# EAGLE design throughHoleAdapterTransistor (EAGLE 6.5.0)
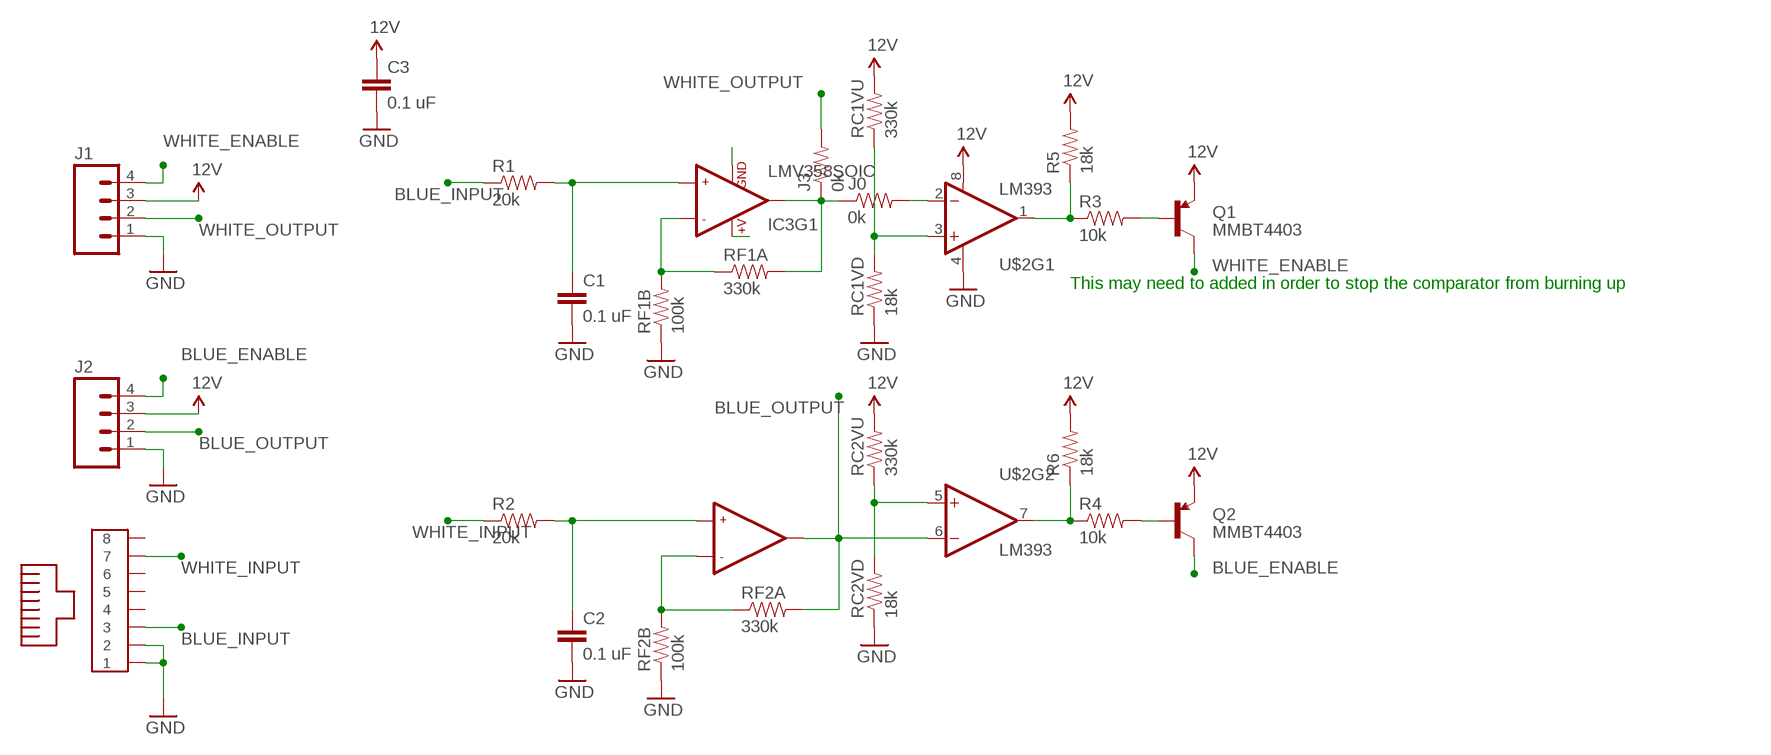
[diagram p0: schematic, sheet 1]

## Parts
C1  0.1 uF  CAP1206  [1206]
C2  0.1 uF  CAP1206  [1206]
C3  0.1 uF  CAP1206  [1206]
IC3  LMV358SOIC  [SO08]
J0  0k  RESISTOR1206  [1206]
J1  M04LONGPADS  [1X04_LONGPADS]
J2  M04LONGPADS  [1X04_LONGPADS]
J3  0k  RESISTOR1206  [1206]
Q1  MMBT4403  TRANSISTOR_PNPMMBT4403  [SOT23-3]
Q2  MMBT4403  TRANSISTOR_PNPMMBT4403  [SOT23-3]
R1  20k  RESISTOR1206  [1206]
R2  20k  RESISTOR1206  [1206]
R3  10k  RESISTOR1206  [1206]
R4  10k  RESISTOR1206  [1206]
R5  18k  RESISTOR1206  [1206]
R6  18k  RESISTOR1206  [1206]
RC1VD  18k  RESISTOR1206  [1206]
RC1VU  330k  RESISTOR1206  [1206]
RC2VD  18k  RESISTOR1206  [1206]
RC2VU  330k  RESISTOR1206  [1206]
RF1A  330k  RESISTOR1206  [1206]
RF1B  100k  RESISTOR1206  [1206]
RF2A  330k  RESISTOR1206  [1206]
RF2B  100k  RESISTOR1206  [1206]
U$1  MOLEX-RJ45-SMT  [MOLEX-RJ45-SMT]
U$2  LM393  [SO08]

## Nets
12V: C3.1 IC3.8(+V) J1.3 J2.3 Q1.2(E) Q2.2(E) R5.2 R6.2 RC1VU.2 RC2VU.2 U$2.8(V+)
BLUE_ENABLE: J2.4 Q2.3(C)
BLUE_INPUT: R1.1 U$1.3
BLUE_OUTPUT: IC3.7(OUT2) J2.2 RF2A.2 U$2.6(-IN)
GND: C1.2 C2.2 C3.2 IC3.4(GND) J1.1 J2.1 RC1VD.1 RC2VD.1 RF1B.1 RF2B.1 U$1.1 U$1.2 U$2.4(V-)
N$1: Q2.1(B) R4.2
N$2: J0.2 U$2.2(-IN)
N$3: R3.1 R5.1 U$2.1(OUT)
N$4: IC3.2(-IN1) RF1A.1 RF1B.2
N$5: RC2VD.2 RC2VU.1 U$2.5(+IN)
N$6: IC3.6(-IN2) RF2A.1 RF2B.2
N$7: C1.1 IC3.3(+IN1) R1.2
N$8: C2.1 IC3.5(+IN2) R2.2
N$9: RC1VD.2 RC1VU.1 U$2.3(+IN)
N$10: Q1.1(B) R3.2
N$11: R4.1 R6.1 U$2.7(OUT)
WHITE_ENABLE: J1.4 Q1.3(C)
WHITE_INPUT: R2.1 U$1.7
WHITE_OUTPUT: J1.2 J3.2
WHITE_OUTPUT_TEMP: IC3.1(OUT1) J0.1 J3.1 RF1A.2
Unconnected: U$1.4 U$1.5 U$1.6 U$1.8

## Notes on the sheet
- This may need to added in order to stop the comparator from burning up

## Library data of the parts
C1-C3 = SparkFun-Capacitors:CAP: Capacitor Standard 0603 ceramic capacitor, and 0.1" leaded capacitor.
IC3 = SparkFun-AnalogIC:LMV358: Jellybean rail-to-rail output op-amp; PROD_ID: IC-09657
J0 J3 R1-R6 RC1VD RC1VU RC2VD RC2VU RF1A RF1B RF2A RF2B = SparkFun-Resistors:RESISTOR: Resistor Basic schematic elements and footprints for 0603, 1206, and PTH resistors.
J1 J2 = SparkFun-Connectors:M04: Header 4 Standard 4-pin 0.1" header. Use with straight break away headers (SKU : PRT-00116), right angle break away headers (PRT-00553), swiss pins (PRT-00743), machine pins (PRT-00117), and female headers (PRT-00115). Molex polarized connector foot print use with SKU : PRT-08231 with associated crimp pins and housings. 1MM SMD Version SKU: PRT-10208; PROD_ID: CONN-09696
Q1 Q2 = SparkFun-DiscreteSemi:TRANSISTOR_PNP: Generic PNP BJT Double check pinouts against datasheets- not all devices are the same! MMBT3906 - 40V 200mA SOT-23 (TRANS-08052) MMBT4403 - 40V 600mA SOT-23 (TRANS-09245); PROD_ID: TRANS-09245
U$1 = SMD-RJ45:MOLEX-RJ45-SMT
U$2 = SparkFun-AnalogIC:LM393: Low-voltage comparator

## Board
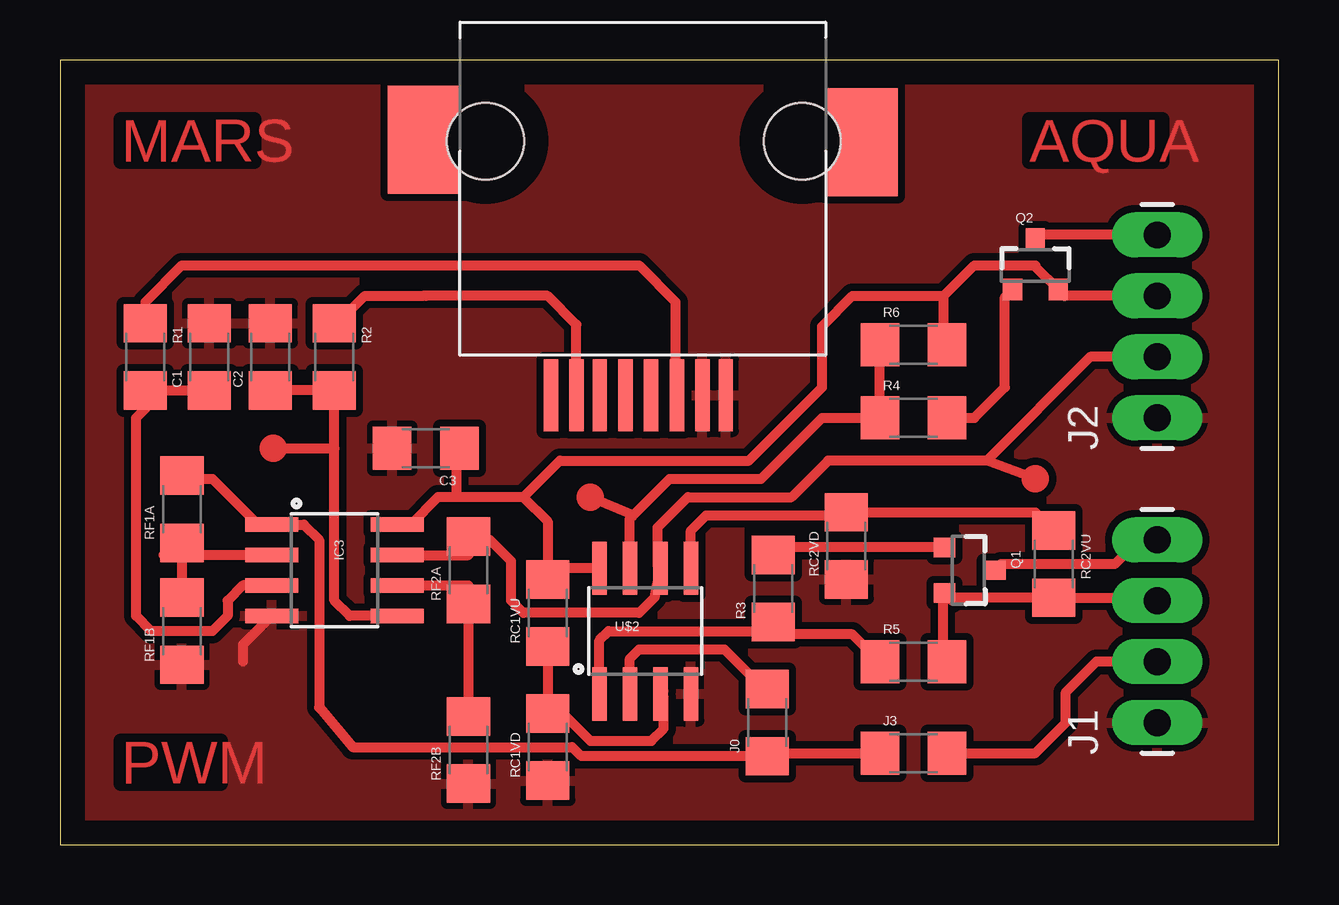
[diagram p1: board, top side]
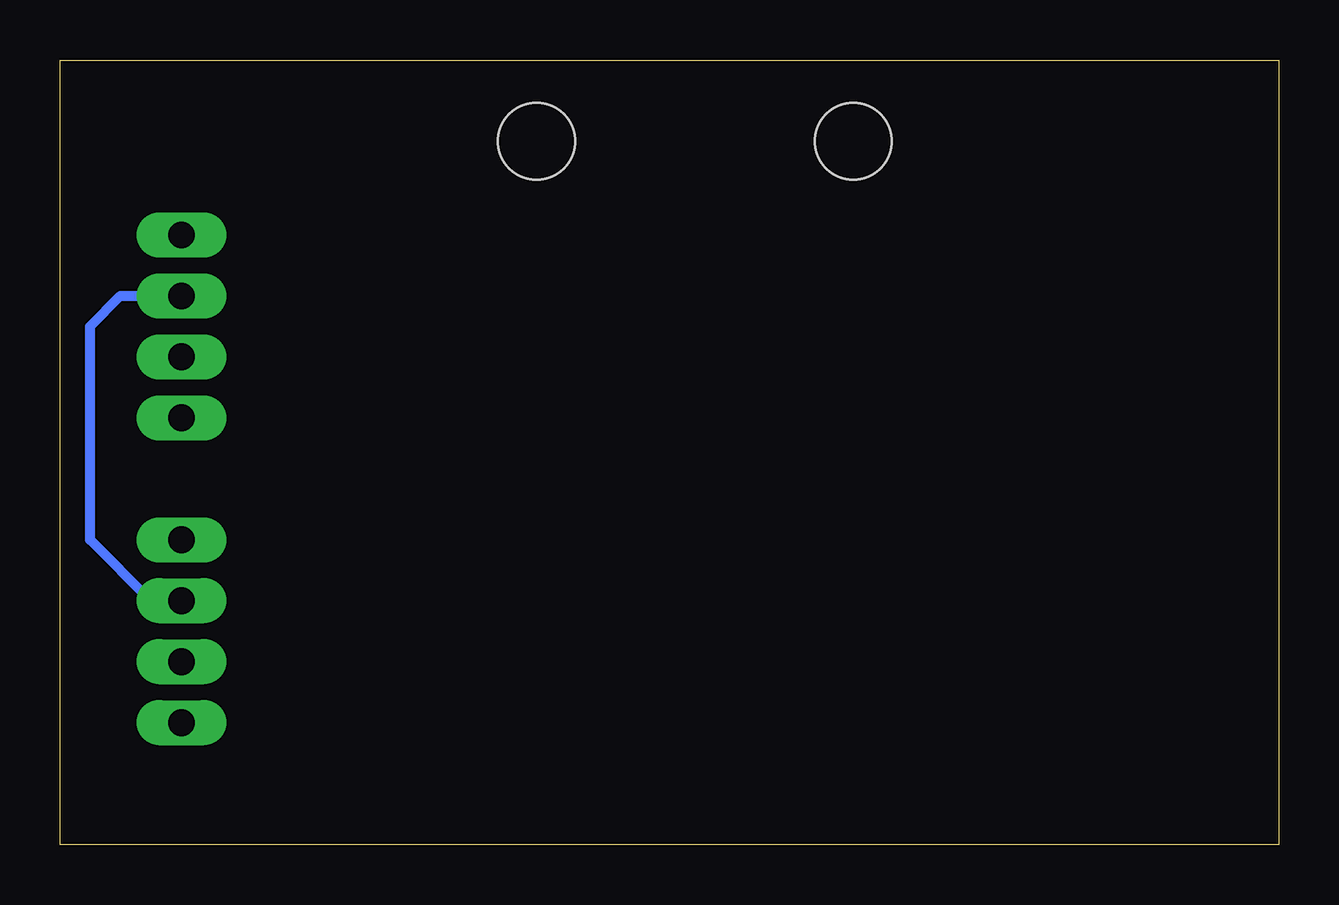
[diagram p2: board, bottom side, seen from below]

Size 50.78 x 32.69 mm. Coordinates in mm from the lower left corner, seen from the top.
Outline: 0,0 50.78,0 50.78,32.69 0,32.69 0,0
Copper layers (1*16): Top 0.035mm / dielectric 1.5mm / Bottom 0.035mm
Design rules "default": minimum track width 10mil, minimum drill 24mil, track to track 8mil, track to pad 8mil, pad to pad 8mil, via to via 8mil, smd to smd 8mil, copper to edge 40mil, drill to drill 8mil, minimum pad ring 10mil, minimum via ring 8mil, stop-mask expansion 4mil, vias tented up to drill 0mil, thermal gap 10mil

### Footprints (pad centres in the part's own frame; a part is rotated, then mirrored left to right if it is on the bottom)
1206 = smd 1.6 x 1.8: 1 -1.4,0; 2 1.4,0
SO08 = smd 0.61 x 2.21: 1 -1.905,-2.616; 2 -0.635,-2.616; 3 0.635,-2.616; 4 1.905,-2.616; 5 1.905,2.616; 6 0.635,2.616; 7 -0.635,2.616; 8 -1.905,2.616
1X04_LONGPADS = drill 1.118 pad 1.88 long: 1 0,0; 2 2.54,0; 3 5.08,0; 4 7.62,0
SOT23-3 = smd 0.8 x 0.9: 1 -0.95,-1; 2 0.95,-1; 3 0,1.1
MOLEX-RJ45-SMT = smd 3 x 0.6: 1 10.48,3.61; 2 10.48,2.64; 3 10.48,1.57; 4 10.48,0.5; 5 10.48,-0.57; 6 10.48,-1.64; 7 10.48,-2.61; 8 10.48,-3.68 | smd 4.5 x 3: P$1 -0.16,-8.97; P$2 -0.06,9.28 | hole 3.2: -0.1,6.8; -0.1,-6.4

### Placement (x,y rotation side)
C1  6.22,20.32 90 top
C2  8.76,20.32 90 top
C3  15.24,16.51 180 top
IC3  11.43,11.43 270 top
J0  29.46,5.08 90 top
J1  45.72,5.08 90 top
J2  45.72,17.78 90 top
J3  35.56,3.81 0 top
Q1  37.85,11.43 270 top
Q2  40.64,24.13 0 top
R1  3.56,20.32 270 top
R2  11.43,20.32 270 top
R3  29.72,10.67 90 top
R4  35.56,17.78 0 top
R5  35.56,7.62 0 top
R6  35.56,20.83 0 top
RC1VD  20.32,4.06 90 top
RC1VU  20.32,9.65 90 top
RC2VD  32.77,12.45 90 top
RC2VU  41.4,11.68 270 top
RF1A  5.08,13.97 90 top
RF1B  5.08,8.89 90 top
RF2A  17.02,11.43 90 top
RF2B  17.02,3.94 90 top
U$1  24.13,29.21 270 top
U$2  24.38,8.89 0 top

### Tracks (layer width: path | path; a pad name or v marks a point on that pad's centre or on a via)
12V
  Top 0.406: IC3.8 14.61,13.34 15.75,14.48 16.51,14.48 | 19.3,14.48 16.51,14.48 | J2.3 41.86,22.86 Q2.2 40.64,24.08 40.64,24.13 38.1,24.13 36.83,22.86 | 19.3,14.48 20.83,16 28.7,16 31.75,19.05 31.75,21.59 33.02,22.86 36.83,22.86 | U$2.8 20.77,11.51 RC1VU.2 20.32,13.46 19.3,14.48 | Q1.2 36.9,10.48 | 37.17,10.16 Q1.2 | 36.78,10.41 Q1.2 | Q1.2 37.04,10.28 RC2VU.2 45.6,10.28 J1.3 | Q1.2 36.79,10.54 36.79,7.79 R5.2 | R6.2 36.83,20.96 36.83,22.86 | C3.1 16.51,16.38 16.51,14.48
  Bottom 0.406: J1.3 46.99,10.16 49.53,12.7 49.53,21.59 48.26,22.86 J2.3
BLUE_ENABLE
  Top 0.406: J2.4 40.81,25.4 Q2.3
BLUE_INPUT
  Top 0.406: U$1.3 25.65,18.78 25.65,22.61 24.13,24.13 5.08,24.13 3.56,22.61 R1.1
BLUE_OUTPUT
  Top 0.406: IC3.7 17.02,12.06 RF2A.2 17.91,12.7 18.8,11.81 18.8,10.16 19.3,9.65 24.13,9.65 24.77,10.29 U$2.6 24.89,11.63 24.89,13.21 26.16,14.48 30.48,14.48 32,16 38.61,16 | J2.2 42.93,20.32 38.61,16 | 40.64,15.24 38.61,16
GND
  Top 0.406: IC3.4 7.62,8.33 7.62,7.62
  pour Top (isolate 0.305): 0,33.02 50.8,33.02 50.8,0 0,0
N$1
  Top 0.406: R4.2 38.1,17.78 39.37,19.05 39.37,22.81 Q2.1
N$2
  Top 0.406: U$2.2 23.75,7.75 24.13,8.13 27.69,8.13 29.33,6.48 J0.2
N$3
  Top 0.406: U$2.1 22.48,8.51 22.86,8.89 29.34,8.89 R3.1 30.23,8.76 33.02,8.76 R5.1
N$4
  Top 0.406: 5.08,12.06 RF1A.1 4.32,12.06 | 5.08,12.06 RF1B.2 | IC3.2 5.08,12.06
N$5
  Top 0.406: U$2.5 26.29,13.08 26.92,13.72 32.64,13.72 RC2VD.2 40.64,13.85 RC2VU.1
N$6
  Top 0.406: IC3.6 17.02,10.79 RF2A.1 RF2B.2
N$7
  Top 0.406: IC3.3 7.62,10.79 6.99,10.16 6.99,9.53 6.35,8.89 3.81,8.89 3.17,9.53 3.17,17.78 3.56,18.16 R1.2 C1.1
N$8
  Top 0.406: IC3.5 12.06,9.53 11.43,10.16 11.43,16.51 | 11.43,16.51 R2.2 | R2.2 | R2.2 C2.1 | 8.89,16.51 11.43,16.51
N$9
  Top 0.406: 25.15,6.4 U$2.3 25.15,6.15 25.15,4.83 24.64,4.32 22.1,4.32 20.95,5.46 RC1VD.2 RC1VU.1
N$10
  Top 0.406: Q1.1 30.03,12.38 R3.2
N$11
  Top 0.406: U$2.7 23.75,13.59 23.88,13.72 | R6.1 R4.1 31.75,17.78 29.21,15.24 25.4,15.24 23.88,13.72 | 23.88,13.72 22.1,14.48
WHITE_ENABLE
  Top 0.406: J1.4 45.47,12.45 44.7,12.45 43.94,11.68 39.2,11.68 Q1.3
WHITE_INPUT
  Top 0.406: U$1.7 21.52,21.66 20.32,22.86 15.24,22.86 15.11,22.86 12.7,22.86 11.56,21.72 R2.1
WHITE_OUTPUT
  Top 0.406: J1.2 43.18,7.62 41.91,6.35 41.91,5.08 40.64,3.81 J3.2
WHITE_OUTPUT_TEMP
  Top 0.406: RF1A.2 5.21,15.24 6.35,15.24 8.26,13.34 IC3.1 10.16,13.34 10.79,12.7 10.79,5.71 12.19,4.06 21.34,4.06 21.72,3.68 J0.1 29.59,3.81 J3.1
(copper drawn outside any net)
  shapes: Top area x8, Top circle x3

### Text on the board
Top: MARS | AQUA | PWM